# Altium schematic sheet pinout.SchDoc
size A
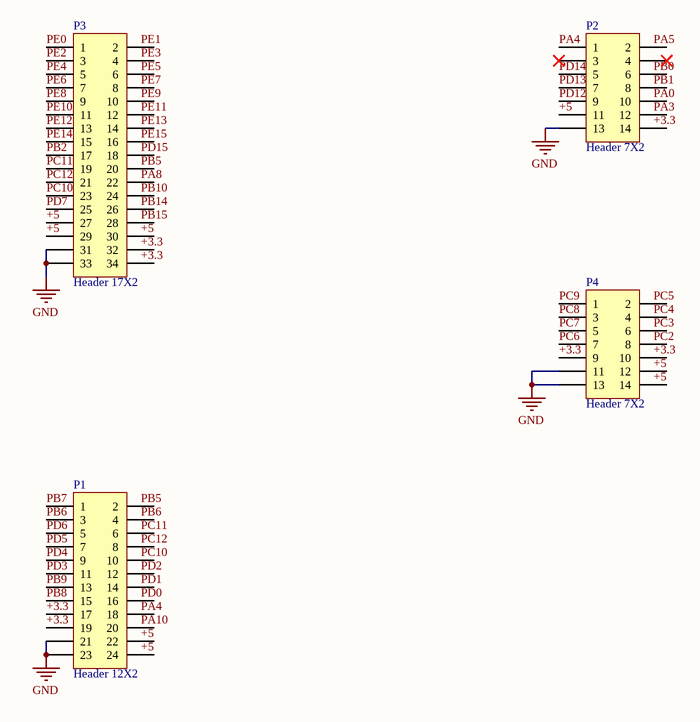
[diagram p0: pinout.SchDoc]

## Parts
P1  Header 12X2  [IDC24S]
P2  Header 7X2  [IDC14S]
P3  Header 17X2  [IDC34S]
P4  Header 7X2  [IDC14S]

## Nets
GND: P1.21 P1.23 P2.13 P3.31 P3.33 P4.11 P4.13
+3.3: P1.17 P1.19 P4.9
+5: P2.11 P3.27 P3.29
PA4: P2.1
PB2: P3.17
PB6: P1.3
PB7: P1.1
PB8: P1.15
PB9: P1.13
PC6: P4.7
PC7: P4.5
PC8: P4.3
PC9: P4.1
PC10: P3.23
PC11: P3.19
PC12: P3.21
PD3: P1.11
PD4: P1.9
PD5: P1.7
PD6: P1.5
PD7: P3.25
PD12: P2.9
PD13: P2.7
PD14: P2.5
PE0: P3.1
PE2: P3.3
PE4: P3.5
PE6: P3.7
PE8: P3.9
PE10: P3.11
PE12: P3.13
PE14: P3.15

Not connected (* = marked no-connect by the designer): P1 2 4 6 8 10 12 14 16 18 20 22 24; P2 2 3* 4* 6 8 10 12 14; P3 2 4 6 8 10 12 14 16 18 20 22 24 26 28 30 32 34; P4 2 4 6 8 10 12 14

## Notes on the sheet
- Labels drawn without touching a wire or pin: +3.3, +5, PA0, PA3, PA4, PA5, PA8, PA10, PB0, PB1, PB5, PB6, PB10, PB14, PB15, PC2, PC3, PC4, PC5, PC10, PC11, PC12, PD0, PD1, PD2, PD15, PE1, PE3, PE5, PE7, PE9, PE11, PE13, PE15

## Library data of the parts
P1 = Header 12X2: Header, 12-Pin, Dual row; LatestRevisionDate: 17-Jul-2002; LatestRevisionNote: Re-released for DXP Platform.; Publisher: Altium Limited
P2 P4 = Header 7X2: Header, 7-Pin, Dual row; LatestRevisionDate: 17-Jul-2002; LatestRevisionNote: Re-released for DXP Platform.; Publisher: Altium Limited
P3 = Header 17X2: Header, 17-Pin, Dual row; LatestRevisionDate: 17-Jul-2002; LatestRevisionNote: Re-released for DXP Platform.; Publisher: Altium Limited